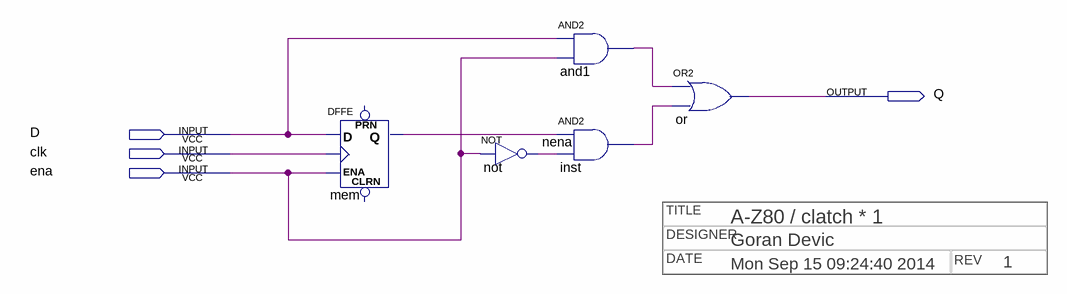
[diagram p0: schematic sheet]
// Quartus schematic clatch1.bdf as structural Verilog: 5 symbols, 4 pins
// Title block: TITLE: A-Z80 / clatch * 1; DESIGNER: Goran Devic; DATE: Mon Sep 15 09:24:40 2014; REV: 1
module clatch1 (
  input  D,
  input  clk,
  input  ena,
  output Q
);

  wire and1_out, inst_out, mem_q, nena;

  DFFE mem (.D(D), .CLK(clk), .ENA(ena), .Q(mem_q));  // open: PRN, CLRN
  not \not  (nena, ena);
  and and1 (and1_out, D, ena);
  and inst (inst_out, mem_q, nena);
  or \or  (Q, and1_out, inst_out);
endmodule
